# Altium schematic sheet LEDs_Switches.SchDoc: Name project title here
size A3; Organization: Krakul OÜ; Address1: Kaare tee 3, lubja; Address2: viimsi vald; Address3: harju maakond; Address4: Estonia 74010; DocumentNumber: No here; Revision: 0; SheetNumber: 6; SheetTotal: 7
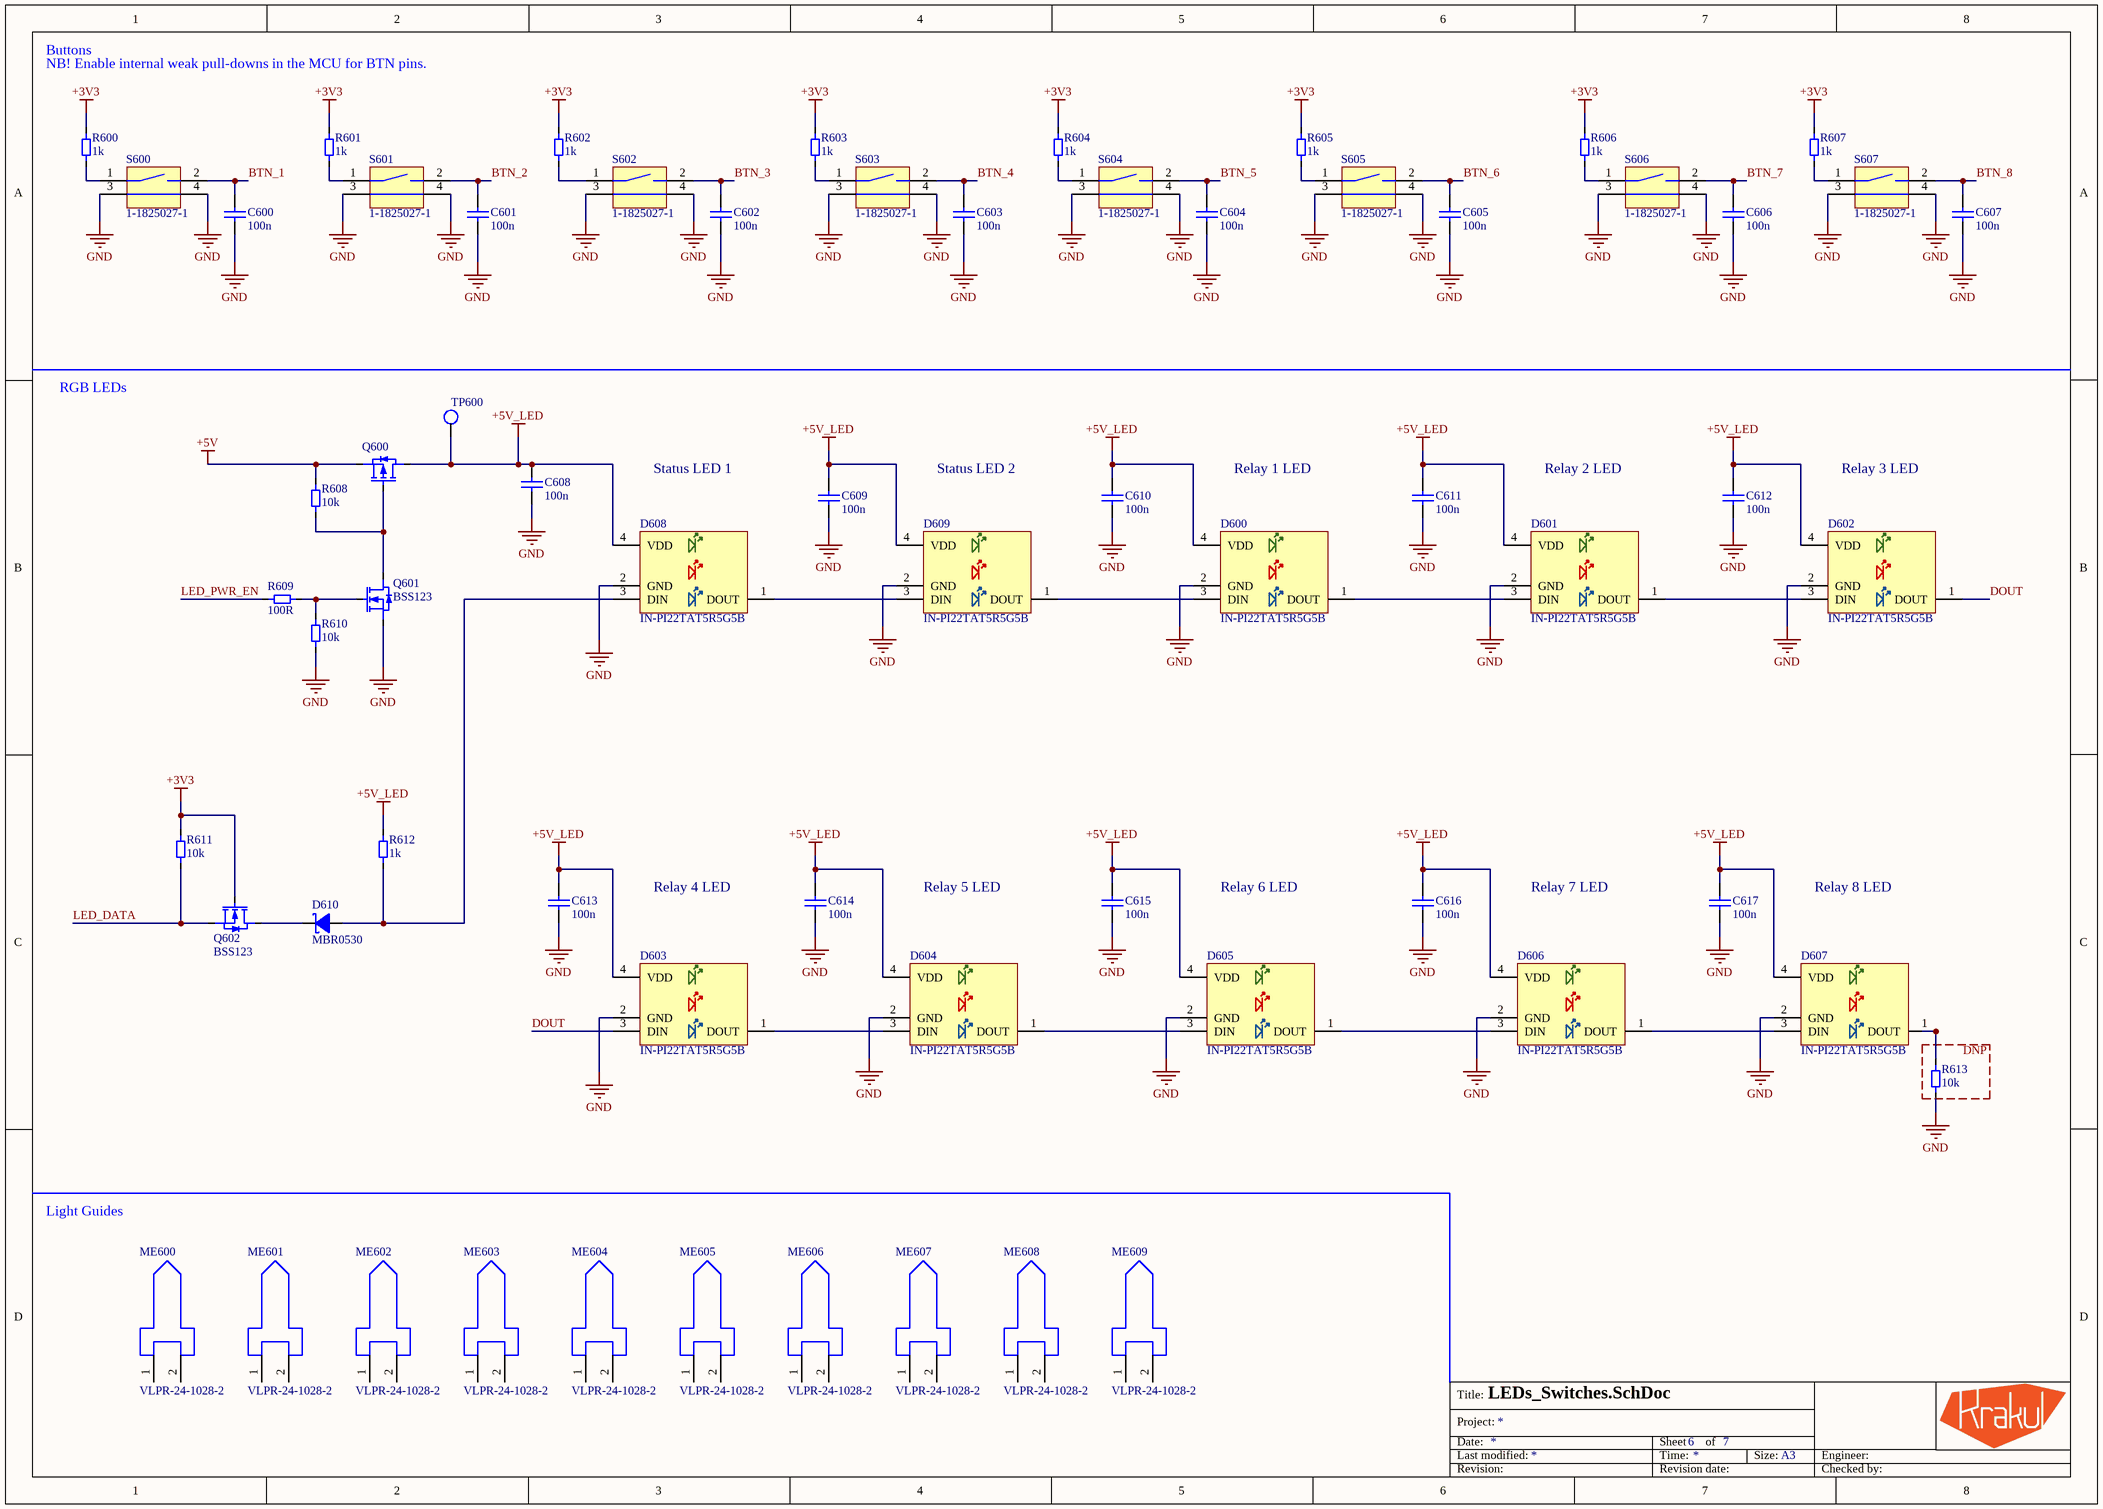
[diagram p0: LEDs_Switches.SchDoc]

## Parts
C600  100n  [MLCC_0402_M]
C601  100n  [MLCC_0402_M]
C602  100n  [MLCC_0402_M]
C603  100n  [MLCC_0402_M]
C604  100n  [MLCC_0402_M]
C605  100n  [MLCC_0402_M]
C606  100n  [MLCC_0402_M]
C607  100n  [MLCC_0402_M]
C608  100n  [MLCC_0402_M]
C609  100n  [MLCC_0402_M]
C610  100n  [MLCC_0402_M]
C611  100n  [MLCC_0402_M]
C612  100n  [MLCC_0402_M]
C613  100n  [MLCC_0402_M]
C614  100n  [MLCC_0402_M]
C615  100n  [MLCC_0402_M]
C616  100n  [MLCC_0402_M]
C617  100n  [MLCC_0402_M]
D600  IN-PI22TAT5R5G5B  [IN-PI22TAT5R5G5B]
D601  IN-PI22TAT5R5G5B  [IN-PI22TAT5R5G5B]
D602  IN-PI22TAT5R5G5B  [IN-PI22TAT5R5G5B]
D603  IN-PI22TAT5R5G5B  [IN-PI22TAT5R5G5B]
D604  IN-PI22TAT5R5G5B  [IN-PI22TAT5R5G5B]
D605  IN-PI22TAT5R5G5B  [IN-PI22TAT5R5G5B]
D606  IN-PI22TAT5R5G5B  [IN-PI22TAT5R5G5B]
D607  IN-PI22TAT5R5G5B  [IN-PI22TAT5R5G5B]
D608  IN-PI22TAT5R5G5B  [IN-PI22TAT5R5G5B]
D609  IN-PI22TAT5R5G5B  [IN-PI22TAT5R5G5B]
D610  MBR0530  [SOD-123]
ME600  VLPR-24-1028-2  [VLPR-24-1028-2-Footprint-1]
ME601  VLPR-24-1028-2  [VLPR-24-1028-2-Footprint-1]
ME602  VLPR-24-1028-2  [VLPR-24-1028-2-Footprint-1]
ME603  VLPR-24-1028-2  [VLPR-24-1028-2-Footprint-1]
ME604  VLPR-24-1028-2  [VLPR-24-1028-2-Footprint-1]
ME605  VLPR-24-1028-2  [VLPR-24-1028-2-Footprint-1]
ME606  VLPR-24-1028-2  [VLPR-24-1028-2-Footprint-1]
ME607  VLPR-24-1028-2  [VLPR-24-1028-2-Footprint-1]
ME608  VLPR-24-1028-2  [VLPR-24-1028-2-Footprint-1]
ME609  VLPR-24-1028-2  [VLPR-24-1028-2-Footprint-1]
Q600  DMG2305UX-13  [SOT-23-3]  (value not drawn)
Q601  BSS123  [SOT-23-3]
Q602  BSS123  [SOT-23-3]
R600  1k  [Resistor_0603_M]
R601  1k  [Resistor_0603_M]
R602  1k  [Resistor_0603_M]
R603  1k  [Resistor_0603_M]
R604  1k  [Resistor_0603_M]
R605  1k  [Resistor_0603_M]
R606  1k  [Resistor_0603_M]
R607  1k  [Resistor_0603_M]
R608  10k  [Resistor_0603_M]
R609  100R  [Resistor_0603_M]
R610  10k  [Resistor_0603_M]
R611  10k  [Resistor_0603_M]
R612  1k  [Resistor_0603_M]
R613  10k  [Resistor_0603_M]
S600  1-1825027-1  [1-1825027-1-Footprint-1]
S601  1-1825027-1  [1-1825027-1-Footprint-1]
S602  1-1825027-1  [1-1825027-1-Footprint-1]
S603  1-1825027-1  [1-1825027-1-Footprint-1]
S604  1-1825027-1  [1-1825027-1-Footprint-1]
S605  1-1825027-1  [1-1825027-1-Footprint-1]
S606  1-1825027-1  [1-1825027-1-Footprint-1]
S607  1-1825027-1  [1-1825027-1-Footprint-1]
TP600  Testpoint 1mm  [Testpoint 1mm]  (value not drawn)  (no BOM)

## Blocks framed on the sheet
DNP: R613

## Nets
+3V3: Q602.1(G) R600.2 R601.2 R602.2 R603.2 R604.2 R605.2 R606.2 R607.2 R611.2
+5V: Q600.2(S) R608.2
+5V_LED: C608.2 C609.2 C610.2 C611.2 C612.2 C613.2 C614.2 C615.2 C616.2 C617.2 D600.4(VDD) D601.4(VDD) D602.4(VDD) D603.4(VDD) D604.4(VDD) D605.4(VDD) D606.4(VDD) D607.4(VDD) D608.4(VDD) D609.4(VDD) Q600.3(D) R612.2 TP600.1
GND: C600.1 C601.1 C602.1 C603.1 C604.1 C605.1 C606.1 C607.1 C608.1 C609.1 C610.1 C611.1 C612.1 C613.1 C614.1 C615.1 C616.1 C617.1 D600.2(GND) D601.2(GND) D602.2(GND) D603.2(GND) D604.2(GND) D605.2(GND) D606.2(GND) D607.2(GND) D608.2(GND) D609.2(GND) Q601.2(S) R610.1 R613.1 S600.3 S600.4 S601.3 S601.4 S602.3 S602.4 S603.3 S603.4 S604.3 S604.4 S605.3 S605.4 S606.3 S606.4 S607.3 S607.4
BTN_1: C600.2 S600.2
BTN_2: C601.2 S601.2
BTN_3: C602.2 S602.2
BTN_4: C603.2 S603.2
BTN_5: C604.2 S604.2
BTN_6: C605.2 S605.2
BTN_7: C606.2 S606.2
BTN_8: C607.2 S607.2
DOUT: D602.1(DOUT) D603.3(DIN)
LED_DATA: Q602.2(S) R611.1
LED_PWR_EN: R609.1
NetD600_1: D600.1(DOUT) D601.3(DIN)
NetD600_3: D600.3(DIN) D609.1(DOUT)
NetD601_1: D601.1(DOUT) D602.3(DIN)
NetD603_1: D603.1(DOUT) D604.3(DIN)
NetD604_1: D604.1(DOUT) D605.3(DIN)
NetD605_1: D605.1(DOUT) D606.3(DIN)
NetD606_1: D606.1(DOUT) D607.3(DIN)
NetD607_1: D607.1(DOUT) R613.2
NetD608_1: D608.1(DOUT) D609.3(DIN)
NetD608_3: D608.3(DIN) D610.2(A) R612.1
NetD610_1: D610.1(C) Q602.3(D)
NetQ600_1: Q600.1(G) Q601.3(D) R608.1
NetQ601_1: Q601.1(G) R609.2 R610.2
NetR600_1: R600.1 S600.1
NetR601_1: R601.1 S601.1
NetR602_1: R602.1 S602.1
NetR603_1: R603.1 S603.1
NetR604_1: R604.1 S604.1
NetR605_1: R605.1 S605.1
NetR606_1: R606.1 S606.1
NetR607_1: R607.1 S607.1

Not connected (* = marked no-connect by the designer): ME600 1 2; ME601 1 2; ME602 1 2; ME603 1 2; ME604 1 2; ME605 1 2; ME606 1 2; ME607 1 2; ME608 1 2; ME609 1 2

## Notes on the sheet
- Buttons
- NB! Enable internal weak pull-downs in the MCU for BTN pins.
- RGB LEDs
- Status LED 1
- Status LED 2
- Relay 1 LED
- Relay 2 LED
- Relay 3 LED
- Relay 4 LED
- Relay 5 LED
- Relay 6 LED
- Relay 7 LED
- Relay 8 LED
- Light Guides
- Title:
- Date:
- Last modified:
- Project:
- Sheet
- Time:
- of
- Size:
- A3
- Engineer:
- Revision:
- Revision date:
- Checked by:

## Library data of the parts
C600-C617 = CMP-001-1256-2: MLCC, 0402, 100n, 10%, 10V, X5R; Manufacturer: Any; Capacitor Type: Ceramic; Value: 100nF; Case/Package: 0402; Part number: MLCC, 0402, 100n, 10%, 10V, X5R; RoHS: Yes; Tolerance: 10%; Mount: SMD; Voltage: 10V; Dielectric: X5R
D600-D609 = CMP-001-1686-5: RGB LED, Discrete, Serial PWM(1Wire); Manufacturer: Inolux; Color: Blue,Green,Red; Number of LEDs: 1; Case/Package: SMD/SMT; Mount: SMD; Part number: IN-PI22TAT5R5G5B; Pins: 4; RoHS: Yes; Interface: Serial; Length: 2.7mm; Mounting Technology: Surface Mount; Packaging: Cut Tape; Series: -; Width: 2.4mm; Datasheet: https://www.inolux-corp.com/datasheet/SMDLED/Addressable%20LED/IN-PI22TAT5R5G5B_v1.2.pdf
D610 = CMP-ROOT-00224-1: Diode Schottky 30V 500mA Surface Mount SOD-123; Manufacturer: ON Semiconductor; Peak Reverse Current: 130uA; Element Configuration: Single; Max Forward Surge Current (Ifsm): 5.5A; Forward Voltage: 430mV; Polarity: Standard; Pins: 2; Average Rectified Current: 500mA; Voltage Rating (DC): 30V; Max Operating Temperature: 150°C; Height: 1.03mm; Part number: MBR0530; Weight: 0.03g; Width: 1.6mm; Max Repetitive Reverse Voltage (Vrrm): 30V; RoHS: Yes; Length: 2.7mm; Mount: Surface Mount; Contact Plating: Tin,Matte; Output Current: 500mA; Max Reverse Leakage Current: 130uA; Forward Current: 500mA; Max Reverse Voltage (DC): 30V; Max Surge Current: 5.5A; Min Operating Temperature: -65°C; Peak Non-Repetitive Surge Current: 5.5A; Radiation Hardening: No; Case/Package: SOD-123; REACH SVHC: No SVHC; Packaging: Tape and Reel; Package Quantity: 1; Lead Free: Lead Free; Current Rating: 500mA; Number of Pins: 2
ME600-ME609 = CMP-ROOT-01098-2: Light Pipe, Rigid, Vertical, Board Mount, Smd Led, 1.028 In., 4 Mm X 2 Mm Rectangular Face; Manufacturer: Bivar; Body Length: 26.1mm; Number of Columns: 1; Case/Package: SMD/SMT; Mount: TH; Part number: VLPR-24-1028-2; RoHS: Yes; Color: Clear; Lead Free: Lead Free; Length: 26.1mm; Material: PC,Polycarbonate; Mounting Technology: Press-Fit,Board,PCB; Number of Rows: 1; Number of Ways: 1; Orientation: Vertical; Package Quantity: 100; Packaging: Bulk; Series: VLPR; Size: 1.058inch
Q600 = CMP-ROOT-00017-1: P-Channel 20V 4.2A (Ta) 1.4W (Ta) Surface Mount SOT-23; Manufacturer: Diodes Incorporated; Drain to Source Breakdown Voltage: -20V; Drain to Source Resistance: 52mR; Fall Time: 34.7ns; Input Capacitance: 808pF; Rise Time: 13.7ns; Element Configuration: Single; Turn-Off Delay Time: 79.3ns; Threshold Voltage: -900mV; On-State Resistance: 65MR; Turn-On Delay Time: 10.8ns; Number of Channels: 1; Gate to Source Voltage (Vgs): 8V; Case/Package: SOT-23; Mount: Surface Mount; Package Quantity: 1; Max Power Dissipation: 1.4W; Length: 3mm; Continuous Drain Current (ID): 4.2A; Weight: 0.000282oz; REACH SVHC: No SVHC; Height: 1.1mm; Lead Free: Lead Free; Min Operating Temperature: -55°C; Rds On Max: 52mR; Packaging: Tape and Reel; Radiation Hardening: No; Number of Pins: 3; Part number: DMG2305UX-13; RoHS: Yes; Max Operating Temperature: 150°C; Width: 1.4mm; Drain to Source Voltage (Vdss): 20V
Q601 Q602 = CMP-ROOT-00113-5: MOSFET N-CH 100V 170MA SOT-23; Manufacturer: ON Semiconductor; Max Power Dissipation: 360mW; On-State Resistance: 6R; Threshold Voltage: 1.7V; Fall Time: 9ns; Input Capacitance: 73pF; Turn-On Delay Time: 1.7ns; Gate to Source Voltage (Vgs): 20V; Turn-Off Delay Time: 17ns; Element Configuration: Single; Number of Elements: 1; Max Operating Temperature: 150°C; Rise Time: 9ns; Nominal Vgs: 1.7V; Height: 0.93mm; Radiation Hardening: No; Power Dissipation: 360mW; Drain to Source Resistance: 6R; Voltage Rating (DC): 100V; Drain to Source Voltage (Vdss): 100V; Package Quantity: 1; Length: 2.92mm; Lead Free: Lead Free; Width: 1.3mm; Drain to Source Breakdown Voltage: 100V; Contact Plating: Tin,Matte; Current Rating: 170mA; Rds On Max: 6R; Dual Supply Voltage: 100V; Voltage: 100V; Number of Pins: 3; Mount: Surface Mount; Part number: BSS123; Continuous Drain Current (ID): 170mA; REACH SVHC: No SVHC; RoHS: Yes; Min Operating Temperature: -55°C; Packaging: Tape and Reel; Case/Package: SOT-23
R600-R607 R612 = CMP-0001-00237-1: Resistor, 0603, 1k, 0.1%, 1/16W; Manufacturer: Any; Mount: SMD; Part number: Any; RoHS: Yes; Case/Package: 0603; Value: 1k
R608 R610 R611 R613 = CMP-001-0101-2: Resistor, 0603, 10k, 1%, 1/10W; Manufacturer: Any; Power: 100mW; Tolerance: 1%; Value: 10k; RoHS: Yes; Mount: SMD; Case/Package: 0603; Part number: Resistor, 0603, 10k, 1%, 1/10W
R609 = CMP-001-0053-3: Resistor, 0603, 100R, 1%, 1/10W; Manufacturer: Any; Value: 100; Power: 100mW; RoHS: Yes; Case/Package: 0603; Tolerance: 1%; Part number: Resistor, 0603, 100R, 1%, 1/10W; Mount: SMD
S600-S607 = CMP-ROOT-01057-1: Switch Push Button OFF (ON) SPST Round Button 0.05A 24VDC Momentary Contact PC Pins Thru-Hole; Manufacturer: TE; Actuator Color: Black; Actuator Length: 0.226inch; Actuator Material: PBT; Actuator Type: Standard; Contact Current Rating: 50mA; Contact Resistance: 100mR; Electrical Life: 100000Cycles; Illumination Type: Non-Illuminated; Max Voltage Rating (DC): 24V; Number of Positions: 2; Operating Force: 160gf; Switch Function: Off-Mom; Switch Travel: 0.25mm; Case/Package: FSMRAJ; Mount: TH; Part number: 1-1825027-1; RoHS: Yes; Color: Black; Contact Material: Copper Alloy; Contact Plating: Silver; Contact Type: 1 maker; Current Rating: 50mA; Depth: 12.36mm; ELV: Compliant; Height: 7.3mm; Illumination Color: Black; Insulation Resistance: 100MR; Lead Free: Lead Free; Length: 7.11mm; Max Current Rating: 50mA; Max Operating Temperature: 85°C; Mechanical Life: 100000Cycles; Min Operating Temperature: -35°C; Mounting Technology: Through Hole; Orientation: Straight; Package Quantity: 1000; Packaging: Loose Piece; Radiation Hardening: No; Reach SVHC Compliant: No; RoHS Compliant: Yes; Series: FSMRAJ, Alcoswitch; Termination: PC Pins; Throw Configuration: SPST; Type: Switch; Voltage Rating (AC): 24V; Width: 6mm
TP600 = CMP-001-1238-1